# EAGLE schematic Modular (EAGLE 9.6.2)

## Sheet 1 of 2
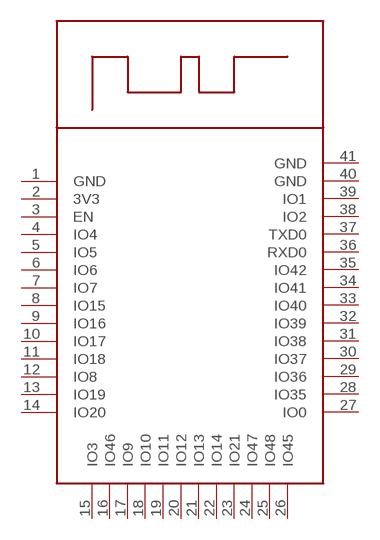
[diagram p0: schematic, sheet 1]

### Parts
U$1  ESP32-S3-WROOM-1-N16  [ESP32-S3-WROOM-1-N16]
Unconnected: U$1.1(GND) U$1.2(3V3) U$1.3(EN) U$1.4(IO4) U$1.5(IO5) U$1.6(IO6) U$1.7(IO7) U$1.8(IO15) U$1.9(IO16) U$1.10(IO17) U$1.11(IO18) U$1.12(IO8) U$1.13(IO19) U$1.14(IO20) U$1.15(IO3) U$1.16(IO46) U$1.17(IO9) U$1.18(IO10) U$1.19(IO11) U$1.20(IO12) U$1.21(IO13) U$1.22(IO14) U$1.23(IO21) U$1.24(IO47) U$1.25(IO48) U$1.26(IO45) U$1.27(IO0) U$1.28(IO35) U$1.29(IO36) U$1.30(IO37) U$1.31(IO38) U$1.32(IO39) U$1.33(IO40) U$1.34(IO41) U$1.35(IO42) U$1.36(RXD0) U$1.37(TXD0) U$1.38(IO2) U$1.39(IO1) U$1.40(GND) U$1.41(GND)

## Sheet 2 of 2

## Library data of the parts
U$1 = Act4_classroom:ESP32-S3-WROOM-1-N16